# EAGLE design adapter_trs_rev_a (EAGLE 7.6.0)
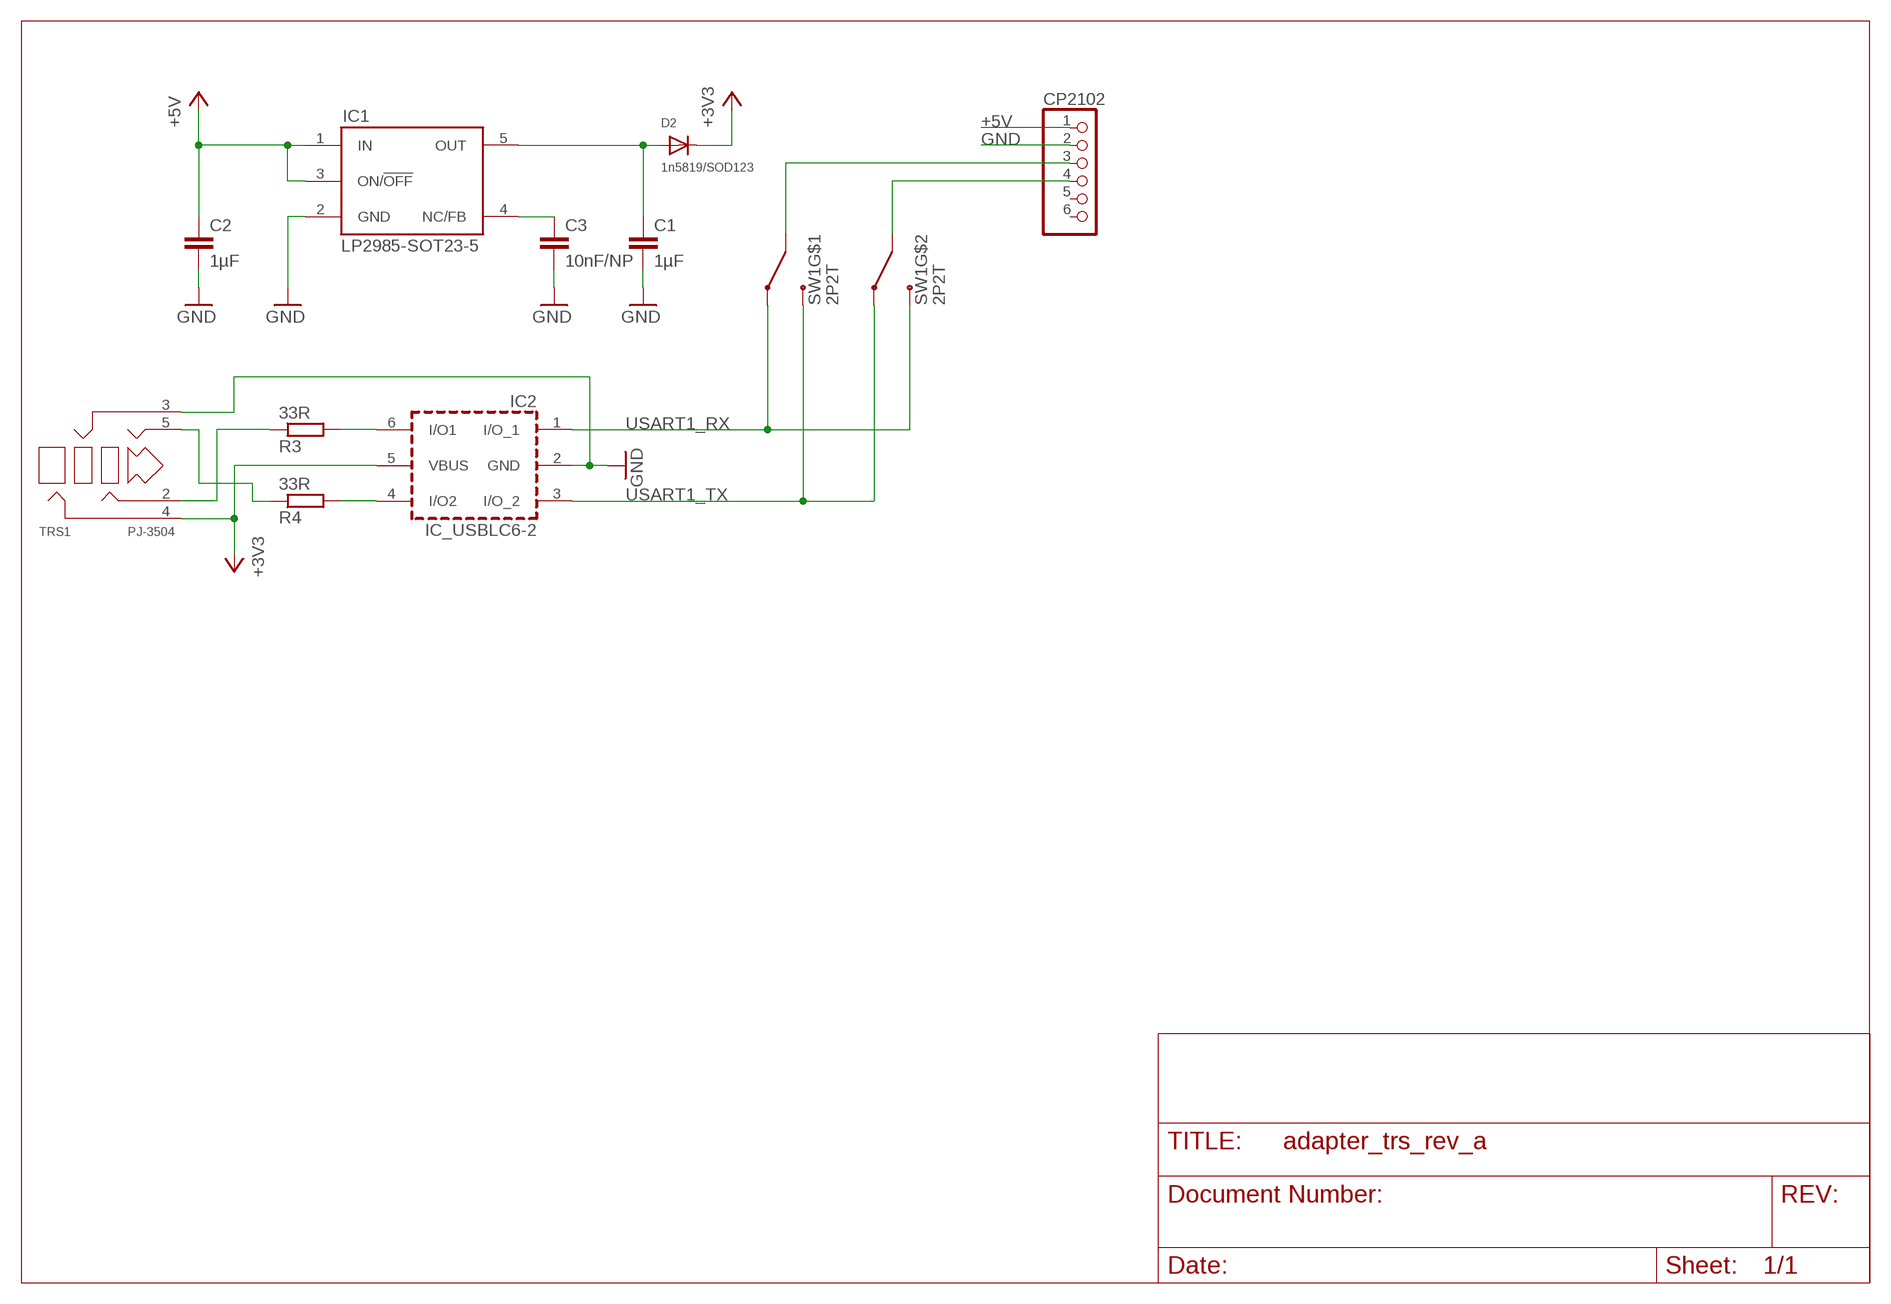
[diagram p0: schematic, sheet 1]

## Parts
C1  1µF  C-EUC0603  [C0603]
C2  1µF  C-EUC0603  [C0603]
C3  10nF/NP  C-EUC0603  [C0603]
CP2102  HEADER-1X6ROUND  [1X06_ROUND]
D2  1n5819/SOD123  DIODESOD-123  [SOD-123]
IC1  LP2985-SOT23-5  [SOT23-5]
IC2  IC_USBLC6-2  [SOT-23-6L]
R3  33R  R-EU_R0603  [R0603]
R4  33R  R-EU_R0603  [R0603]
SW1  2P2T  [MSS22D18]
TRS1  PJ-3504  [YD-PJ-3504]

## Nets
+3V3: D2.C IC2.5(VBUS) TRS1.4
+5V: C2.1 CP2102.1 IC1.1(IN) IC1.3(ON/!OFF)
GND: C1.2 C2.2 C3.2 CP2102.2 IC1.2(GND) IC2.2(GND) TRS1.3
N$1: C1.1 D2.A IC1.5(OUT)
N$2: C3.1 IC1.4(NC/FB)
N$4: R3.1 TRS1.2
N$6: CP2102.3 SW1.C1(C)
N$7: IC2.6(I/O1) R3.2
N$8: R4.1 TRS1.5
N$9: CP2102.4 SW1.C2(C)
N$25: IC2.4(I/O2) R4.2
USART1_RX: IC2.1(I/O_1) SW1.A1(A) SW1.B2(B)
USART1_TX: IC2.3(I/O_2) SW1.A2(A) SW1.B1(B)
Unconnected: CP2102.5 CP2102.6

## Library data of the parts
C1-C3 = rcl:C-EU: CAPACITOR, European symbol
CP2102 = microbuilder:HEADER-1X6: PIN HEADER
D2 = microbuilder:DIODE: Diode SMA Model Volts Amps Type Vf Vr Digikey # Notes SSA34-E3 40V 3A Schottky 480mV @ 3A 200uA @ 40V SSA34-E3/61TGITR-ND CDBA120-G 20V 1A Schottky 500mV @ 1A 500uA @ 20V 641-1014-6-ND REEL MBRA210 10V 2A Schottky 350mV @ 2A 700uA @ 10V MBRA210LT3 SOD-123 Model Volts Amps Type Vf Vr Order # Notes BAT54T1G 30V 200mA Schottky 800mV @ 200mA 2uA @ 25V BAT54T1GOSTR-ND B0530W 30V 500mA Schottky 430mV @ 500mA 130uA @ 30V B0530W-FDICT-ND REEL MBR120 1A 20V Schottky 340mV @ 1A MBR120VLSFT1GOSCT-ND SOD-323 Model Volts Amps Type Vf Vr Order # Notes PMEG2005EJ 20V 500mA Schottky 355mV @ 500mA 568-4110-1-ND ZLLS410 10V 570mA Schottky 380mV @ 570mA ZLLS410CT-ND 1N4148WS 75V 150mA Silicon/Simple 1V 1N4148WSFSCT-ND REEL SOD-523 Model Volts Amps Type Vf Vr Order # Notes BAT54XV2 30V 200mA Schottky 0.8V @ 100mA BAT54XV2CT-ND TB751S 30V 30mA Schottky RB751S-40TE61CT-ND SOT23-R/W (R = Solder Paste/Reflow Ovens, W = Hand-Soldering) Model Volts Amps Type Vf Vr Order # Notes BAT54FILM 40V 300mA Schottky 497-7162-1-ND
IC1 = vreg:LP2985
IC2 = dp_devices:IC_USBLC6-2
R3 R4 = rcl:R-EU_: RESISTOR, European symbol
SW1 = switch:2P2T
TRS1 = con-trs:PJ-3504

## Board
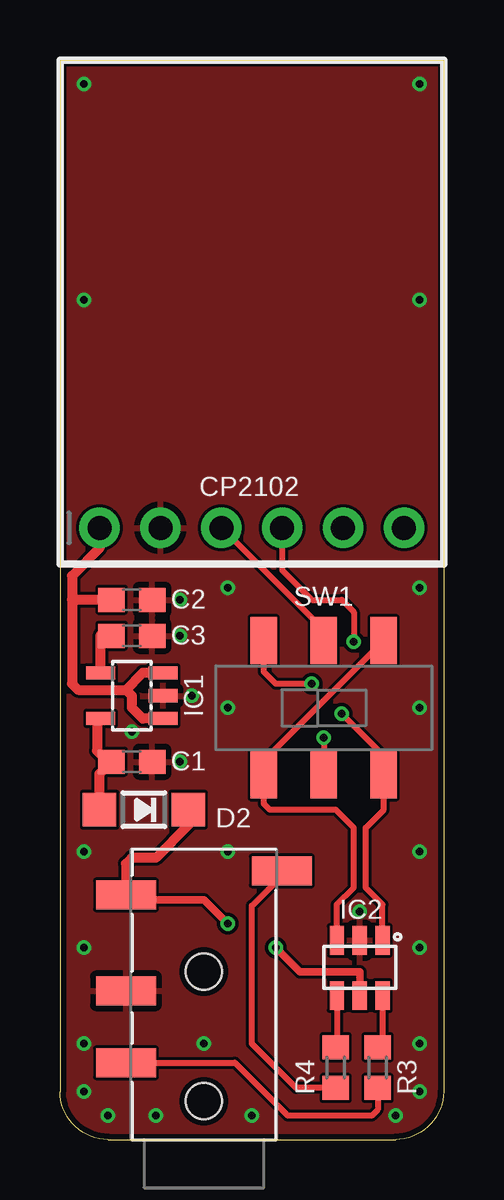
[diagram p1: board, top side]
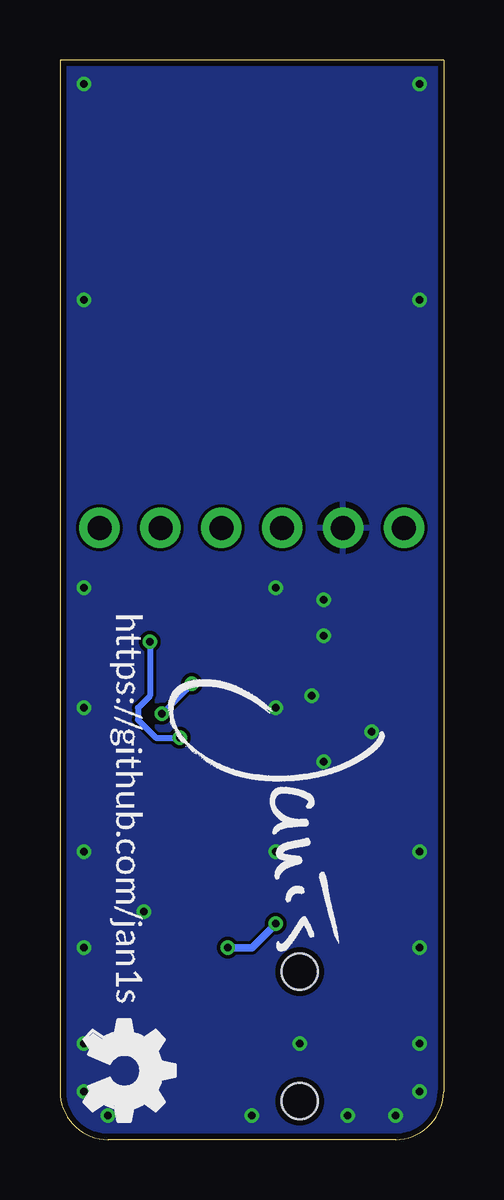
[diagram p2: board, bottom side, seen from below]

Size 16 x 45 mm. Coordinates in mm from the lower left corner, seen from the top.
Outline: 2,0 14,0 arc90 16,2 16,45 0,45 0,2 arc90 2,0
Copper layers (1*16): Top 0.035mm / dielectric 1.5mm / Bottom 0.035mm
Design rules "default": minimum track width 5mil, minimum drill 12mil, track to track 5mil, track to pad 5mil, pad to pad 5mil, via to via 5mil, smd to smd 0mil, copper to edge 10mil, drill to drill 10mil, minimum pad ring 10mil, minimum via ring 6mil, stop-mask expansion 2mil, vias tented up to drill 25mil, thermal gap 10mil

### Footprints (pad centres in the part's own frame; a part is rotated, then mirrored left to right if it is on the bottom)
C0603 = smd 1.1 x 1: 1 -0.85,0; 2 0.85,0
1X06_ROUND = drill 1 pad 1.676: 1 -6.35,0; 2 -3.81,0; 3 -1.27,0; 4 1.27,0; 5 3.81,0; 6 6.35,0
SOD-123 = smd 1.4 x 1.4: A 1.85,0; C -1.85,0
SOT23-5 = smd 0.55 x 1.2: 1 -0.95,-1.3; 2 0,-1.3; 3 0.95,-1.3; 4 0.95,1.3; 5 -0.95,1.3
SOT-23-6L = smd 0.6 x 1.2: 1 -0.95,-2.3; 2 0,-2.3; 3 0.95,-2.3; 4 0.95,0; 5 0,0; 6 -0.95,0
R0603 = smd 1 x 1.1: 1 -0.85,0; 2 0.85,0
MSS22D18 = smd 1.1 x 1.95: A1 -2.5,2.8; A2 -2.5,-2.8; B1 2.5,2.8; B2 2.5,-2.8; C1 0,2.8; C2 0,-2.8
YD-PJ-3504 = smd 1.2 x 2.5: 2 3.2,3.25; 3 6.2,3.25; 4 10.2,3.25; 5 11.2,-3.25 | hole 1.5: 1.6,0; 7,0

### Placement (x,y rotation side)
C1  3,15.75 0 top
C2  3,22.5 0 top
C3  3,21 0 top
CP2102  8,25.5 0 top
D2  3.5,13.75 180 top
IC1  3,18.5 90 top
IC2  12.5,6 180 top
R3  13.25,3 90 top
R4  11.5,3 90 top
SW1  11,18 0 top
TRS1  6,0 90 top
U$1  [OSHW_FILLX150_NOTEXT]  15,5 270 bottom
U$2  [JANIS_10MM]  11.75,19.5 270 bottom
U$6  [GITHUB/JAN1S]  13.75,22 270 bottom

### Tracks (layer width: path | path; a pad name or v marks a point on that pad's centre or on a via)
+3V3  (via drill 0.32)
  Top 0.305: IC2.5 12.5,7 10,7 v9,8 | v7,9 6,10 3.75,10
  Top 0.406: TRS1.4 3.75,10 | TRS1.4 3.2,10.2 3.5,10.5 | D2.C 5.35,13.1 4,11.75 3,11.75 2.75,11.5 TRS1.4
  Bottom 0.305: v9,8 8,8 v7,9
+5V
  Top 0.406: CP2102.1 1.65,24.65 0.5,23.5 0.5,22.5 | 0.5,22.5 0.5,19 0.75,18.75 2.75,18.75 | 2.75,18.75 3.45,19.45 IC1.3 | IC1.1 3.45,17.55 3,18 3,18.5 2.75,18.75 | C2.1 0.5,22.5
GND  (via drill 0.32)
  other vias: 6,4 4,1 1,4 1,2 2,1 12.5,9.5 1,8 1,12 7,12 8,1 14,1 15,2 15,4 15,8 15,12 15,18 15,23 7,18 7,23 5.5,18.5 3,17 5,15.75 5,21 1,44 15,44 1,35 15,35 5,22.5
  pour Top (rank 5): 0,45 16,45 16,1 15,0 1,0 0,1
  pour Bottom: 0,45 16,45 16,1 15,0 12.5,0 12.5,-1 11,-1 11,0 1,0 0,1
N$1
  Top 0.406: IC1.5 1.55,17.55 1.55,16.2 2,15.75 C1.1 1.65,15.25 D2.A
N$2
  Top 0.406: IC1.4 1.7,21.05 C3.1
N$4
  Top 0.254: TRS1.2 7.3,3.2 9.5,1 13,1 13.25,1.25 R3.1
N$6
  Top 0.254: CP2102.3 6.75,25.5 11,21.25 SW1.C1
N$7
  Top 0.254: IC2.6 13.45,4.05 R3.2
N$8
  Top 0.254: R4.1 9.85,2.15 8,4 8,9.75 9.25,11 TRS1.5
N$9  (via drill 0.32)
  Top 0.254: CP2102.4 9.27,23.73 10.5,22.5 11.75,22.5 12.25,22 v12.25,20.75 | v11,16.75 SW1.C2
  Bottom 0.254: v12.25,20.75 12.25,18.5 12.75,18 12.75,17.5 12,16.75 v11,16.75
N$25
  Top 0.254: IC2.4 11.55,3.9 R4.2
USART1_RX  (via drill 0.32)
  Top 0.254: IC2.1 13.45,9.8 12.75,10.5 12.75,13 13.5,13.75 SW1.B2 13.5,16 v11.75,17.75 | v10.5,19 9,19 8.5,19.5 SW1.A1
  Bottom 0.254: v11.75,17.75 v10.5,19
USART1_TX
  Top 0.254: IC2.3 11.55,9.8 12.25,10.5 12.25,13 11.5,13.75 8.75,13.75 8.5,14 SW1.A2 | SW1.A2 8.5,15.8 SW1.B1 | SW1.A2 8.5,14.75